# EAGLE design Voltage Controlled Amplifier v1 (EAGLE 6.6.0)

## Sheet 1 of 2: Power
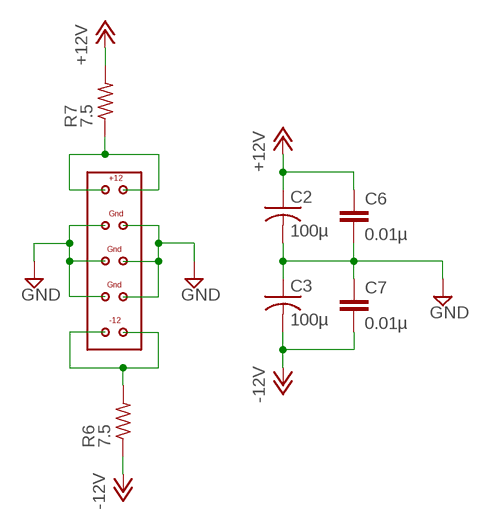
[diagram p0: schematic, sheet 1]

### Parts
C2  100µ  C-US025-050X050  [C025-050X050]
C3  100µ  C-US025-050X050  [C025-050X050]
C6  0.01µ  C2.5/2  [C2.5-2]
C7  0.01µ  C2.5/2  [C2.5-2]
R6  7.5  R-US_0204/7  [0204/7]
R7  7.5  R-US_0204/7  [0204/7]
U$1  EURORACK-POWER  [EURORACK-POWER]

### Nets
+12V: C2.1 C6.1 R7.2 ; also sheet 2
-12V: C3.2 C7.2 R6.1 ; also sheet 2
GND: C2.2 C3.1 C6.2 C7.1 U$1.P$3 U$1.P$4 U$1.P$5 U$1.P$6 U$1.P$7 U$1.P$8 ; also sheet 2
N$8: R6.2 U$1.P$9 U$1.P$10
N$10: R7.1 U$1.P$1 U$1.P$2

## Sheet 2 of 2
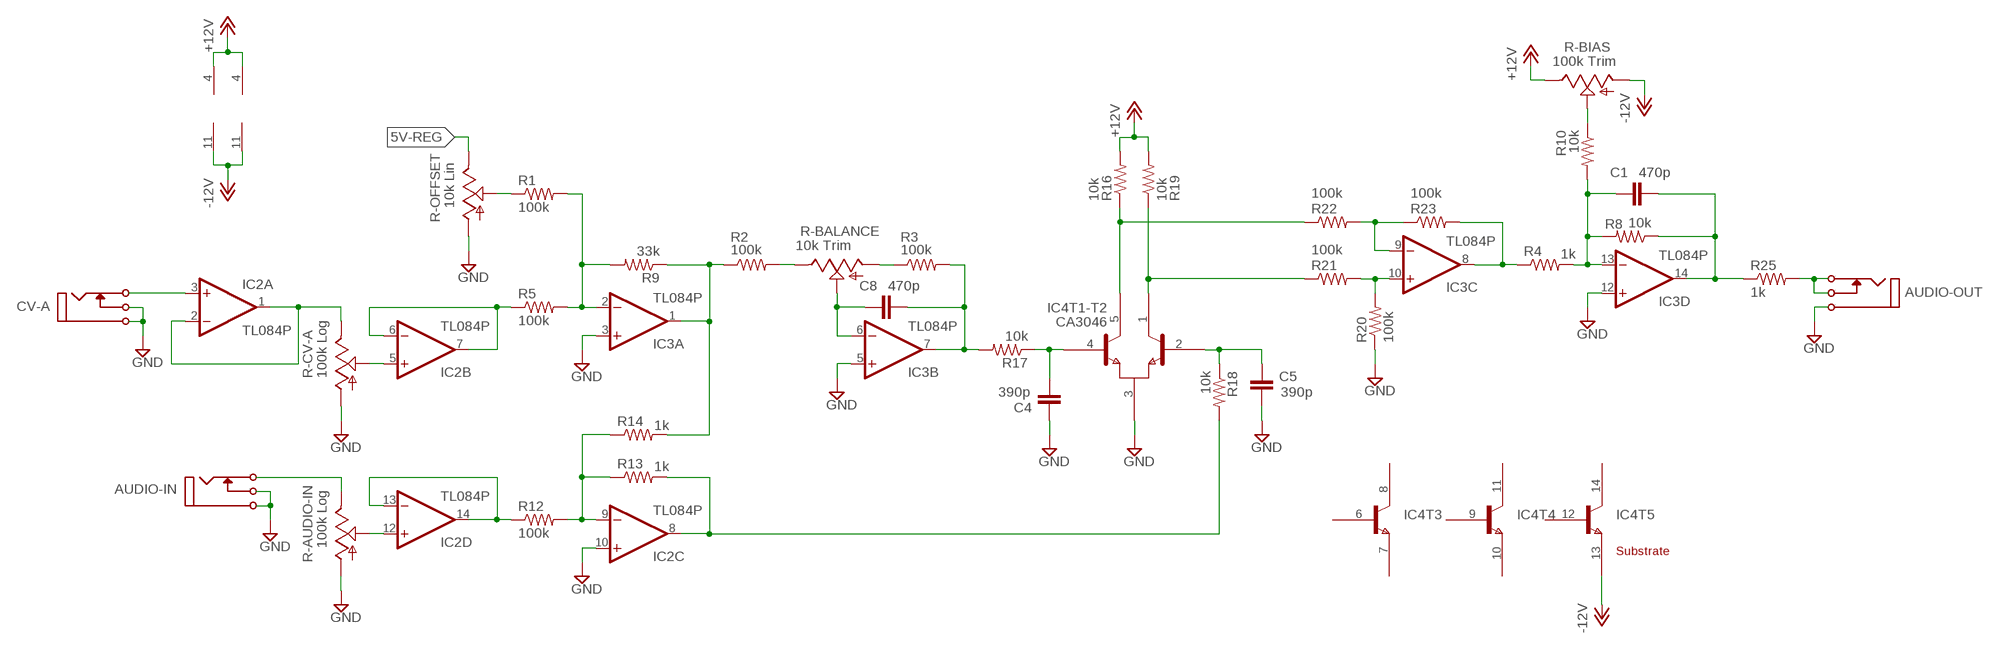
[diagram p1: schematic, sheet 2]

### Parts
AUDIO-IN  I/O  MONO_JACK  [MONO_JACK]
AUDIO-OUT  I/O  MONO_JACK  [MONO_JACK]
C1  470p  C2.5/2  [C2.5-2]
C4  390p  C2.5/2  [C2.5-2]
C5  390p  C2.5/2  [C2.5-2]
C8  470p  C2.5/2  [C2.5-2]
CV-A  I/O  MONO_JACK  [MONO_JACK]
IC2  TL084P  [DIL14]
IC3  TL084P  [DIL14]
IC4  CA3046  [DIL14]
R1  100k  R-US_0204/2V  [0204V]
R2  100k  R-US_0204/2V  [0204V]
R3  100k  R-US_0204/2V  [0204V]
R4  1k  R-US_0204/2V  [0204V]
R5  100k  R-US_0204/2V  [0204V]
R8  10k  R-US_0204/2V  [0204V]
R9  33k  R-US_0204/2V  [0204V]
R10  10k  R-US_0204/2V  [0204V]
R12  100k  R-US_0204/2V  [0204V]
R13  1k  R-US_0204/2V  [0204V]
R14  1k  R-US_0204/2V  [0204V]
R16  10k  R-US_0204/2V  [0204V]
R17  10k  R-US_0204/2V  [0204V]
R18  10k  R-US_0204/7  [0204/7]
R19  10k  R-US_0204/2V  [0204V]
R20  100k  R-US_0204/2V  [0204V]
R21  100k  R-US_0204/2V  [0204V]
R22  100k  R-US_0204/2V  [0204V]
R23  100k  R-US_0204/2V  [0204V]
R25  1k  R-US_0204/7  [0204/7]
R-AUDIO-IN  100k Log  TRIM_US-B64Y  [B64Y]
R-BALANCE  10k Trim  TRIM_US-B64Y  [B64Y]
R-BIAS  100k Trim  TRIM_US-B64Y  [B64Y]
R-CV-A  100k Log  TRIM_US-B64Y  [B64Y]
R-OFFSET  10k Lin  TRIM_US-B64Y  [B64Y]

### Nets
5V-REG: R-OFFSET.E
+12V: IC2.4(P:V+) IC3.4(P:V+) R16.2 R19.2 R-BIAS.E ; also sheet 1
-12V: IC2.11(P:V-) IC3.11(P:V-) IC4.13(T5:E) R-BIAS.A ; also sheet 1
GND: AUDIO-IN.P$1 AUDIO-IN.P$3(P3) AUDIO-OUT.P$1 C4.1 C5.2 CV-A.P$1 CV-A.P$3(P3) IC2.10(C:+IN) IC3.3(A:+IN) IC3.5(B:+IN) IC3.12(D:+IN) IC4.3(T1-T2:E) R20.1 R-AUDIO-IN.A R-CV-A.A R-OFFSET.A ; also sheet 1
N$1: IC2.6(B:-IN) IC2.7(B:OUT) R5.1
N$2: C4.2 IC4.4(T1-T2:B2) R17.1
N$3: CV-A.P$2(P2) IC2.3(A:+IN)
N$4: IC2.1(A:OUT) IC2.2(A:-IN) R-CV-A.E
N$5: R2.2 R-BALANCE.E
N$6: IC3.2(A:-IN) R1.2 R5.2 R9.2
N$7: R3.1 R-BALANCE.A
N$9: AUDIO-IN.P$2(P2) R-AUDIO-IN.E
N$11: R10.1 R-BIAS.S
N$13: R1.1 R-OFFSET.S
N$14: IC2.5(B:+IN) R-CV-A.S
N$15: IC3.1(A:OUT) R2.1 R9.1 R14.2
N$18: IC2.13(D:-IN) IC2.14(D:OUT) R12.1
N$19: IC2.12(D:+IN) R-AUDIO-IN.S
N$20: C1.1 IC3.13(D:-IN) R4.2 R8.2 R10.2
N$21: C5.1 IC4.2(T1-T2:B1) R18.1
N$22: IC2.9(C:-IN) R12.2 R13.1 R14.1
N$23: C8.2 IC3.7(B:OUT) R3.2 R17.2
N$24: IC4.5(T1-T2:C2) R16.1 R22.1
N$25: C8.1 IC3.6(B:-IN) R-BALANCE.S
N$26: IC4.1(T1-T2:C1) R19.1 R21.1
N$27: IC2.8(C:OUT) R13.2 R18.2
N$28: IC3.10(C:+IN) R20.2 R21.2
N$30: IC3.9(C:-IN) R22.2 R23.1
N$31: IC3.8(C:OUT) R4.1 R23.2
N$32: AUDIO-OUT.P$2(P2) AUDIO-OUT.P$3(P3) R25.2
N$34: C1.2 IC3.14(D:OUT) R8.1 R25.1
Unconnected: IC4.6(T3:B) IC4.7(T3:E) IC4.8(T3:C) IC4.9(T4:B) IC4.10(T4:E) IC4.11(T4:C) IC4.12(T5:B) IC4.14(T5:C)

## Library data of the parts
AUDIO-IN AUDIO-OUT CV-A = !synth_sch:MONO_JACK
C1 C4-C8 = capacitor-wima:C: CAPACITOR naming: grid - package width
C2 C3 = rcl:C-US: CAPACITOR, American symbol
IC2 IC3 = linear:TL084: OP AMP
IC4 = !synthdiy:CA3046: NPN Transistor Array
R1-R10 R12-R14 R16-R23 R25 = resistor:R-US_: RESISTOR, American symbol
R-AUDIO-IN R-BALANCE R-BIAS R-CV-A R-OFFSET = pot:TRIM_US-: POTENTIOMETER
U$1 = !synth_sch:EURORACK-POWER

## Board
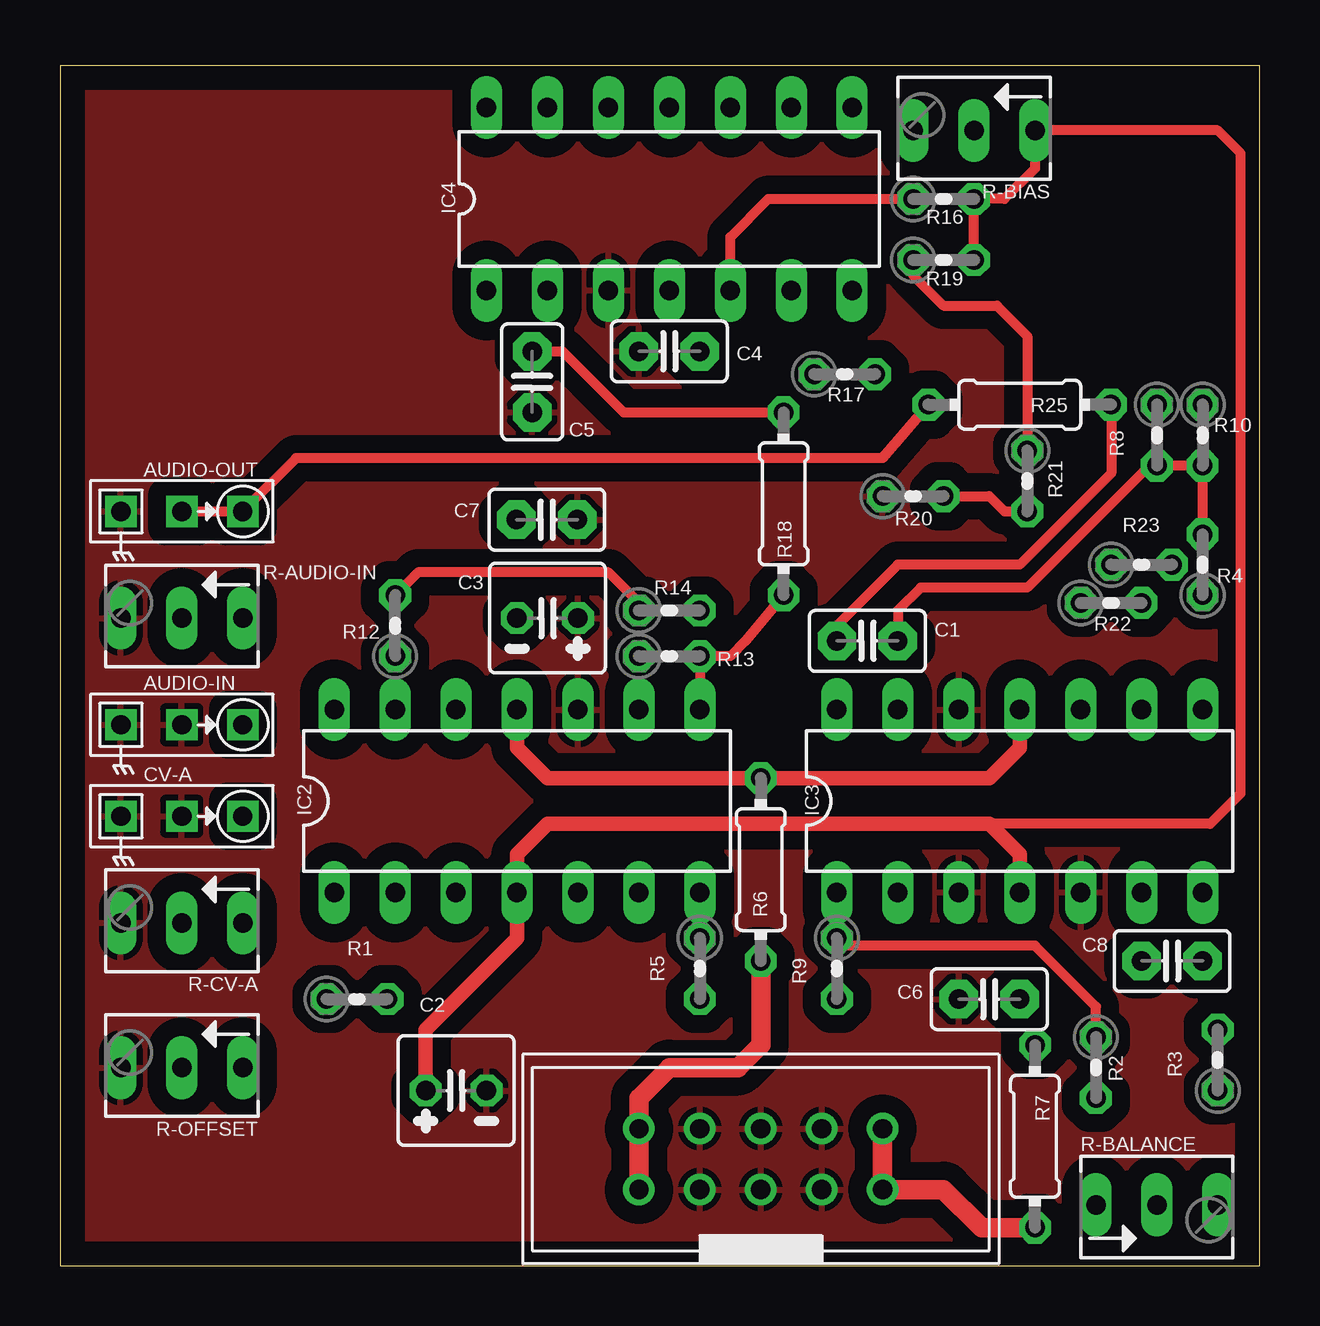
[diagram p2: board, top side]
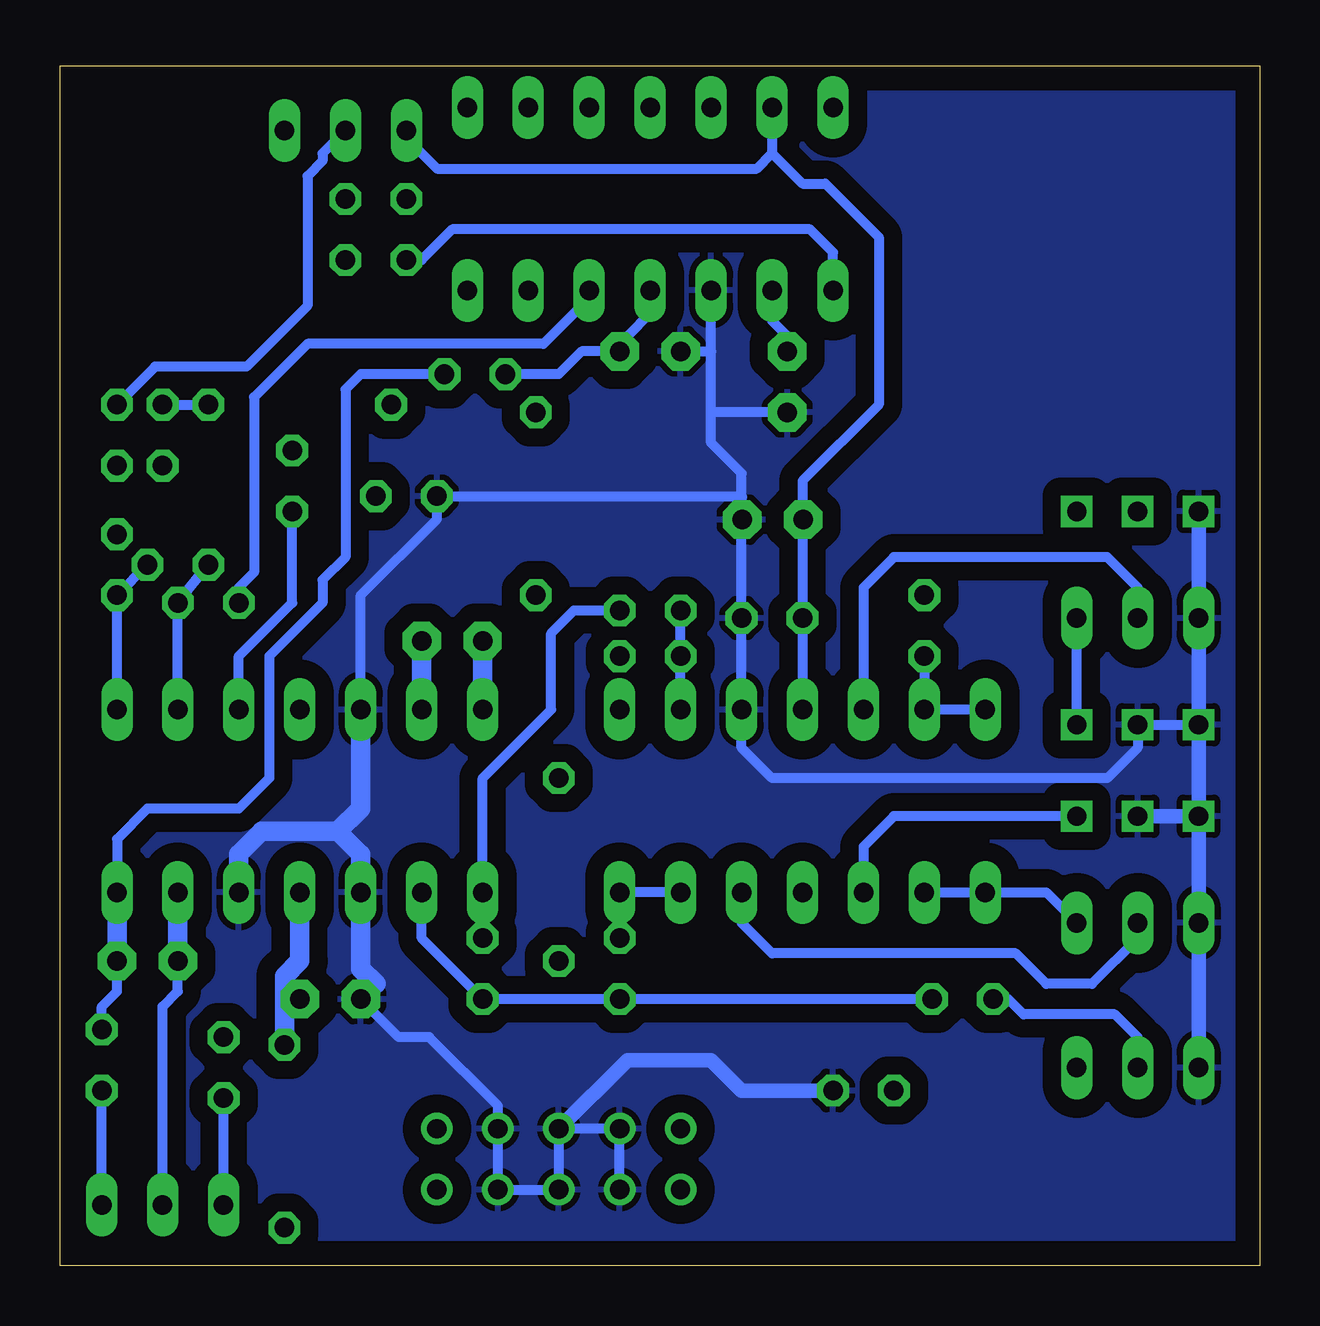
[diagram p3: board, bottom side, seen from below]

Size 50 x 50 mm. Coordinates in mm from the lower left corner, seen from the top.
Outline: 0,0 50,0 50,50 0,50 0,0
Copper layers (1*16): Top 0.035mm / dielectric 1.5mm / Bottom 0.035mm
Design rules "default": minimum track width 10mil, minimum drill 24mil, track to track 8mil, track to pad 8mil, pad to pad 8mil, via to via 8mil, smd to smd 8mil, copper to edge 40mil, drill to drill 8mil, minimum pad ring 10mil, minimum via ring 8mil, stop-mask expansion 4mil, vias tented up to drill 0mil, thermal gap 10mil

### Footprints (pad centres in the part's own frame; a part is rotated, then mirrored left to right if it is on the bottom)
MONO_JACK = drill 0.8 square: P$1 -2.54,0; P$2 2.54,0; P$3 0,0
C2.5-2 = drill 0.813 pad 1.6 octagon: 1 -1.27,0; 2 1.27,0
C025-050X050 = drill 0.813 octagon: 1 -1.27,0; 2 1.27,0
DIL14 = drill 0.813 long: 1 -7.62,-3.81; 2 -5.08,-3.81; 3 -2.54,-3.81; 4 0,-3.81; 5 2.54,-3.81; 6 5.08,-3.81; 7 7.62,-3.81; 8 7.62,3.81; 9 5.08,3.81; 10 2.54,3.81; 11 0,3.81; 12 -2.54,3.81; 13 -5.08,3.81; 14 -7.62,3.81
0204V = drill 0.813 octagon: 1 -1.27,0; 2 1.27,0
0204/7 = drill 0.813 octagon: 1 -3.81,0; 2 3.81,0
B64Y = drill 0.813 long: A 2.54,0; E -2.54,0; S 0,0
EURORACK-POWER = drill 0.8: P$1 -1.27,5.08; P$2 1.27,5.08; P$3 -1.27,2.54; P$4 1.27,2.54; P$5 -1.27,0; P$6 1.27,0; P$7 -1.27,-2.54; P$8 1.27,-2.54; P$9 -1.27,-5.08; P$10 1.27,-5.08

### Placement (x,y rotation side)
AUDIO-IN  5.08,22.54 0 top
AUDIO-OUT  5.08,31.43 0 top
C1  33.66,26.04 180 top
C2  16.51,7.3 0 top
C3  20.32,26.99 180 top
C4  25.4,38.1 0 top
C5  19.68,36.83 270 top
C6  38.73,11.11 180 top
C7  20.3,31.09 180 top
C8  46.35,12.7 0 top
CV-A  5.08,18.73 0 top
IC2  19.05,19.37 0 top
IC3  40.01,19.37 0 top
IC4  25.4,44.45 0 top
R1  12.38,11.11 0 top
R2  43.18,8.26 270 top
R3  48.26,8.57 90 top
R4  47.62,29.21 90 top
R5  26.67,12.38 270 top
R6  29.21,16.51 270 top
R7  40.64,5.4 90 top
R8  45.72,34.61 270 top
R9  32.38,12.38 270 top
R10  47.62,34.61 270 top
R12  13.97,26.67 90 top
R13  25.4,25.4 0 top
R14  25.4,27.3 0 top
R16  36.83,44.45 0 top
R17  32.7,37.15 0 top
R18  30.16,31.75 270 top
R19  36.83,41.91 0 top
R20  35.56,32.07 0 top
R21  40.32,32.7 270 top
R22  43.81,27.62 0 top
R23  45.09,29.21 0 top
R25  40.01,35.88 180 top
R-AUDIO-IN  5.08,26.99 180 top
R-BALANCE  45.72,2.54 0 top
R-BIAS  38.1,47.31 180 top
R-CV-A  5.08,14.29 180 top
R-OFFSET  5.08,8.26 180 top
U$1  29.21,4.45 270 top

### Tracks (layer width: path | path; a pad name or v marks a point on that pad's centre or on a via)
+12V
  Top 0.406: R19.2 R16.2 39.37,44.45 40.64,45.72 R-BIAS.E 48.26,47.31 49.21,46.35 49.21,19.68 47.94,18.41 38.73,18.41
  Top 0.61: IC3.4 40.01,17.14 38.73,18.41 20.32,18.41 19.05,17.14 IC2.4 19.05,13.65 15.24,9.84 C2.1
  Bottom 0.813: R7.2 40.64,11.75 | 40.64,11.75 40.64,12.06 40.01,12.7 IC3.4 | C6.1 40.64,11.75
-12V
  Top 0.61: IC2.11 19.05,21.59 20.32,20.32 29.53,20.32 | 29.53,20.32 38.73,20.32 40.01,21.59 IC3.11 | R6.1 29.21,20.64 29.53,20.32
  Bottom 0.406: IC4.13 20.32,46.35 | 20.32,46.35 19.05,45.09 18.1,45.09 15.88,42.86 15.88,35.88 19.05,32.7 19.05,31.11 C7.2 19.05,31.09 C3.2 IC2.11 | R-BIAS.A 35.56,46.99 34.29,45.72 20.95,45.72 20.32,46.35
GND
  Bottom 0.406: AUDIO-IN.P$1 AUDIO-IN.P$3 5.08,21.59 6.35,20.32 20.32,20.32 21.59,21.59 IC2.10 C3.1 21.59,32.07 | 21.59,32.07 R20.1 34.29,31.11 37.47,27.94 IC3.12 | C5.2 22.86,35.56 | 22.86,35.56 22.86,38.1 | 22.86,38.1 IC4.3 | C7.1 21.57,32.04 21.59,32.07 | 21.59,32.07 21.59,33.02 22.86,34.29 22.86,35.56 | C4.1 22.86,38.1 | U$1.P$8 U$1.P$7 U$1.P$5 U$1.P$6 U$1.P$4 U$1.P$3 31.75,6.67 34.61,9.53 35.88,9.53 C6.2
  Bottom 0.61: R-AUDIO-IN.A AUDIO-IN.P$1 CV-A.P$1 | CV-A.P$3 CV-A.P$1 | CV-A.P$1 R-CV-A.A R-OFFSET.A AUDIO-OUT.P$1 | C2.2 21.59,7.3 22.86,8.57 26.35,8.57 U$1.P$5
  Bottom 0.813: IC3.5 42.55,17.14 41.59,18.1 38.42,18.1 | 38.42,18.1 37.47,17.14 IC3.3 37.47,12.38 36.83,11.75 C6.2 | IC3.12 37.47,19.05 38.42,18.1
  pour Bottom (isolate 0.762): 0,49.53 0,0 49.85,0 49.85,49.85 0,49.85
  pour Top (isolate 0.762): 0,49.85 49.85,49.85 49.85,0 0,0
N$1
  Bottom 0.406: IC2.6 IC2.7 R5.1
N$2
  Bottom 0.406: R17.1 29.21,37.15 28.26,38.1 C4.2 26.35,38.42 26.35,38.73 25.4,39.69 IC4.4
N$3
  Bottom 0.406: CV-A.P$2 15.24,18.73 16.51,17.46 IC2.3
N$4
  Bottom 0.406: IC2.2 IC2.1 8.89,15.56 R-CV-A.E
N$5
  Bottom 0.406: R-BALANCE.E R2.2
N$6
  Bottom 0.406: R1.2 R5.2 R9.2 34.92,13.65 IC3.2
N$7
  Bottom 0.406: R-BALANCE.A R3.1
N$8
  Top 0.813: U$1.P$10 U$1.P$9 24.13,6.99 25.4,8.26 28.26,8.26 29.21,9.21 R6.2
N$9
  Bottom 0.406: AUDIO-IN.P$2 R-AUDIO-IN.E
N$10
  Top 0.813: U$1.P$1 U$1.P$2 36.83,3.17 38.42,1.59 R7.1
N$11
  Bottom 0.406: R-BIAS.S 39.05,46.35 39.05,46.04 39.69,45.4 39.69,40.01 42.23,37.47 46.04,37.47 R10.1
N$13
  Bottom 0.406: R-OFFSET.S 5.08,9.53 6.03,10.48 9.84,10.48 10.48,11.11 R1.1
N$14
  Bottom 0.406: R-CV-A.S 5.08,13.65 6.99,11.75 8.89,11.75 10.16,13.02 20.32,13.02 21.59,14.29 IC2.5
N$15
  Top 0.406: R2.1 43.18,10.79 40.64,13.34 32.7,13.34 R9.1
  Bottom 0.406: R9.1 IC3.1 32.38,20.32 29.53,23.18 29.53,26.35 28.57,27.3 R14.2
N$18
  Bottom 0.406: IC2.14 IC2.13 R12.1
N$19
  Bottom 0.406: R-AUDIO-IN.S 5.08,28.26 6.35,29.53 15.24,29.53 16.51,28.26 IC2.12
N$20
  Top 0.406: C1.1 34.92,27.3 35.88,28.26 40.32,28.26 45.4,33.34 R8.2 R10.2 R4.2
  Bottom 0.813: C1.1 IC3.13
N$21
  Top 0.406: C5.1 20.95,38.1 23.5,35.56 R18.1
  Bottom 0.406: C5.1 19.68,38.73 20.32,39.37 IC4.2
N$22
  Top 0.406: R14.1 24.13,27.62 22.86,28.89 14.92,28.89 R12.2
  Bottom 0.406: IC2.9 R13.1 R14.1
N$23
  Bottom 0.406: R3.2 48.26,10.79 47.62,11.43 C8.2 | R17.2 37.47,37.15 38.1,36.51 38.1,29.53 39.05,28.57 39.05,27.62 41.27,25.4 41.27,20.32 42.55,19.05 46.35,19.05 47.62,17.78 IC3.7
  Bottom 0.813: C8.2 IC3.7
N$24
  Top 0.406: IC4.5 27.94,42.86 29.53,44.45 R16.1
  Bottom 0.406: IC4.5 27.94,40.32 29.84,38.42 39.69,38.42 41.91,36.2 41.91,28.89 42.55,28.26 R22.1
N$25
  Bottom 0.406: R-BALANCE.S 45.72,10.79 45.09,11.43 C8.1
  Bottom 0.813: IC3.6 C8.1
N$26
  Top 0.406: R19.1 35.56,41.27 36.83,40.01 39.05,40.01 40.32,38.73 R21.1
  Bottom 0.406: IC4.1 17.78,42.23 18.73,43.18 33.66,43.18 34.92,41.91 R19.1
N$27
  Top 0.406: IC2.8 R13.2 27.94,25.4 28.57,26.04 R18.2
N$28
  Top 0.406: R20.2 38.73,32.07 39.37,31.43 R21.2
  Bottom 0.406: IC3.10 42.55,25.4 40.32,27.62 R21.2
N$30
  Bottom 0.406: R23.1 R22.2 IC3.9
N$31
  Bottom 0.406: R23.2 R4.1 IC3.8
N$32
  Top 0.406: R25.2 34.29,33.66 9.84,33.66 AUDIO-OUT.P$2 AUDIO-OUT.P$3
N$34
  Top 0.406: R25.1 43.81,33.02 40.01,29.21 34.92,29.21 32.38,26.67 C1.2
  Bottom 0.406: R8.1 R25.1
  Bottom 0.813: IC3.14 C1.2